# EAGLE design flexpcb segmented (EAGLE 9.6.2)
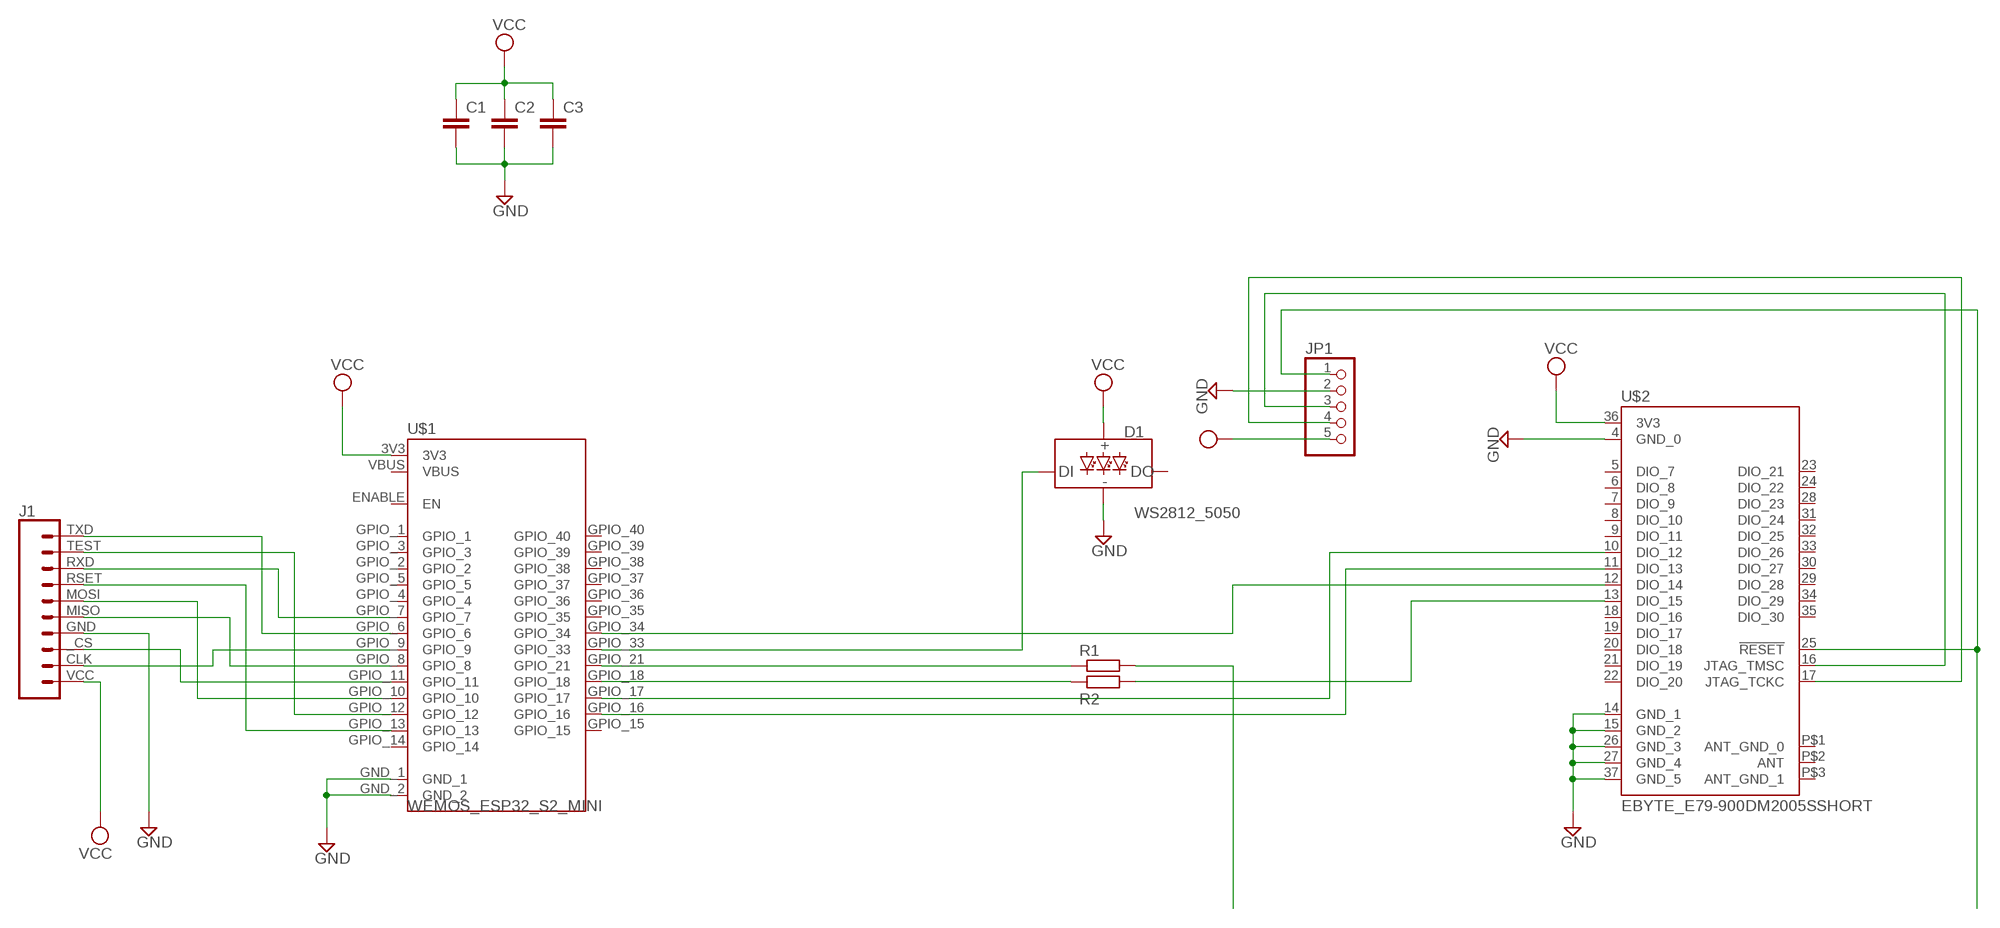
[diagram p0: schematic, sheet 1]

## Parts
C1  C-EUC1206  [C1206]
C2  C-EUC1206  [C1206]
C3  C-EUC1206  [C1206]
D1  WS2812_5050  [WS2812-5X5-4PIN]
J1  SOLUM_ZBS_DEBUGSEGMENTED_DISPLAY  [SOLUM_ZBS_DEBUG_SEG]
JP1  PINHD-1X55X2MM  [1_05X2MM]
R1  R-EU_R0805  [R0805]
R2  R-EU_R0805  [R0805]
U$1  WEMOS_ESP32_S2_MINI  [WEMOS_ESP32_S2_MINI]
U$2  EBYTE_E79-900DM2005SSHORT  [EBYTE_E79-900DM2005S_PARTIAL]

## Nets
GND [power]: C1.2 C2.2 C3.2 D1.GND J1.GND JP1.2 U$1.GND_1 U$1.GND_2 U$2.4(GND_0) U$2.14(GND_1) U$2.15(GND_2) U$2.26(GND_3) U$2.27(GND_4) U$2.37(GND_5)
N$1: JP1.1 U$2.25(!RESET)
N$2: R1.1 U$1.GPIO_21
N$3: R2.2 U$2.13(DIO_15)
N$4: R2.1 U$1.GPIO_18
N$5: U$1.GPIO_34 U$2.12(DIO_14)
N$6: U$1.GPIO_16 U$2.11(DIO_13)
N$7: U$1.GPIO_17 U$2.10(DIO_12)
N$8: D1.DI U$1.GPIO_33
N$9: JP1.3 U$2.16(JTAG_TMSC)
N$10: JP1.4 U$2.17(JTAG_TCKC)
N$11: J1.TEST U$1.GPIO_12
N$12: J1.RSET U$1.GPIO_13
N$13: J1._CS U$1.GPIO_11
N$14: J1.MOSI U$1.GPIO_10
N$15: J1.CLK U$1.GPIO_9
N$16: R1.2
N$17: J1.RXD U$1.GPIO_7
N$18: J1.TXD U$1.GPIO_6
N$19: J1.MISO U$1.GPIO_8
VCC [power]: C1.1 C2.1 C3.1 D1.VCC J1.VCC JP1.5 U$1.3V3 U$2.36(3V3)
Unconnected: D1.DO U$1.ENABLE(EN) U$1.GPIO_1 U$1.GPIO_2 U$1.GPIO_3 U$1.GPIO_4 U$1.GPIO_5 U$1.GPIO_14 U$1.GPIO_15 U$1.GPIO_35 U$1.GPIO_36 U$1.GPIO_37 U$1.GPIO_38 U$1.GPIO_39 U$1.GPIO_40 U$2.5(DIO_7) U$2.6(DIO_8) U$2.7(DIO_9) U$2.8(DIO_10) U$2.9(DIO_11) U$2.18(DIO_16) U$2.19(DIO_17) U$2.20(DIO_18) U$2.21(DIO_19) U$2.22(DIO_20) U$2.23(DIO_21) U$2.24(DIO_22) U$2.28(DIO_23) U$2.29(DIO_28) U$2.30(DIO_27) U$2.31(DIO_24) U$2.32(DIO_25) U$2.33(DIO_26) U$2.34(DIO_29) U$2.35(DIO_30)

## Power pins joined to a net without a drawn wire
ANT: U$2.P$2(ANT)
ANT_GND_0: U$2.P$1(ANT_GND_0)
ANT_GND_1: U$2.P$3(ANT_GND_1)
VBUS: U$1.VBUS

## Library data of the parts
C1-C3 = rcl:C-EU: CAPACITOR, European symbol; SPICEPREFIX: C
D1 = SparkFun-LED:WS2812: Addressable RGB LED - 1 Wire Common names: WS2812, SK6812, Neopixel, APA-106, etc. SMD LED with built-in controller IC. Color: Red/Green/Blue SparkFun Products: LED-SMD RGB (WS2812) <https://www.sparkfun.com/products/11821> LED - RGB Addressable, PTH, 5mm Diffused (5 Pack) <https://www.sparkfun.com/products/12986> LED - RGB Addressable, PTH, 5mm Clear (5 Pack) <https://www.sparkfun.com/products/12999> Blynk Board - ESP8266 <https://www.sparkfun.com/products/13794> Datasheet referenced for footprint: WS2812B-PTH <https://cdn.sparkfun.com/datasheets/Components/LED/COM-12877.pdf>; PROD_ID: DIO-12503
J1 = SparkFun-Connectors:SOLUM_ZBS_DEBUG: Multi connection point. Often used as Generic Header-pin footprint for 0.1 inch spaced/style header connections On any of the 0.1 inch spaced packages, you can populate with these: Break Away Headers - Straight <https://www.sparkfun.com/products/116> (PRT-00116) Break Away Male Headers - Right Angle <https://www.sparkfun.com/products/553> (PRT-00553) Female Headers <https://www.sparkfun.com/products/115> (PRT-00115) Break Away Headers - Machine Pin <https://www.sparkfun.com/products/117> (PRT-00117) Break Away Female Headers - Swiss Machine Pin <https://www.sparkfun.com/products/743> (PRT-00743) Arduino Stackable Header - 10 Pin <https://www.sparkfun.com/products/11376> (PRT-11376) For SCREWTERMINALS and SPRING TERMINALS visit here: Screw Terimnals on SparkFun.com <https://www.sparkfun.com/search/results?term=Screw+Terminals> (5mm/3.5mm/2.54mm spacing) This device is also useful as a general connection point to wire up your design to another part of your project. Our various solder wires solder well into these plated through hole pads. Hook-Up Wire - Assortment (Stranded, 22 AWG) <https://www.sparkfun.com/products/11375> (PRT-11375) Hook-Up Wire - Assortment (Solid Core, 22 AWG) <https://www.sparkfun.com/products/11367> (PRT-11367) View the entire wire category on our website here <https://www.sparkfun.com/categories/141> Special notes: Molex polarized connector foot print use with SKU : PRT-08231 with associated crimp pins and housings. 1MM SMD Version SKU: PRT-10208 NOTES ON THE VARIANTS LOCK and LOCK_LONGPADS... This footprint was designed to help hold the alignment of a through-hole component (i.e. 6-pin header) while soldering it into place. You may notice that each hole has been shifted either up or down by 0.005 of an inch from it's more standard position (which is a perfectly straight line). This slight alteration caused the pins (the squares in the middle) to touch the edges of the holes. Because they are alternating, it causes a "brace" to hold the component in place. 0.005 has proven to be the perfect amount of "off-center" position when using our standard breakaway headers. Although looks a little odd when you look at the bare footprint, once you have a header in there, the alteration is very hard to notice. Also,if you push a header all the way into place, it is covered up entirely on the bottom side.
JP1 = pinhead:PINHD-1X5: PIN HEADER
R1 R2 = rcl:R-EU_: RESISTOR, European symbol; SPICEPREFIX: R
U$1 = SparkFun-Connectors:WEMOS_ESP32_S2_MINI
U$2 = SparkFun-Connectors:EBYTE_E79-900DM2005S

## Net classes
0 default: width 0.12 mm, clearance 0.12 mm
1 power: width 0.61 mm, clearance 0.12 mm

## Board
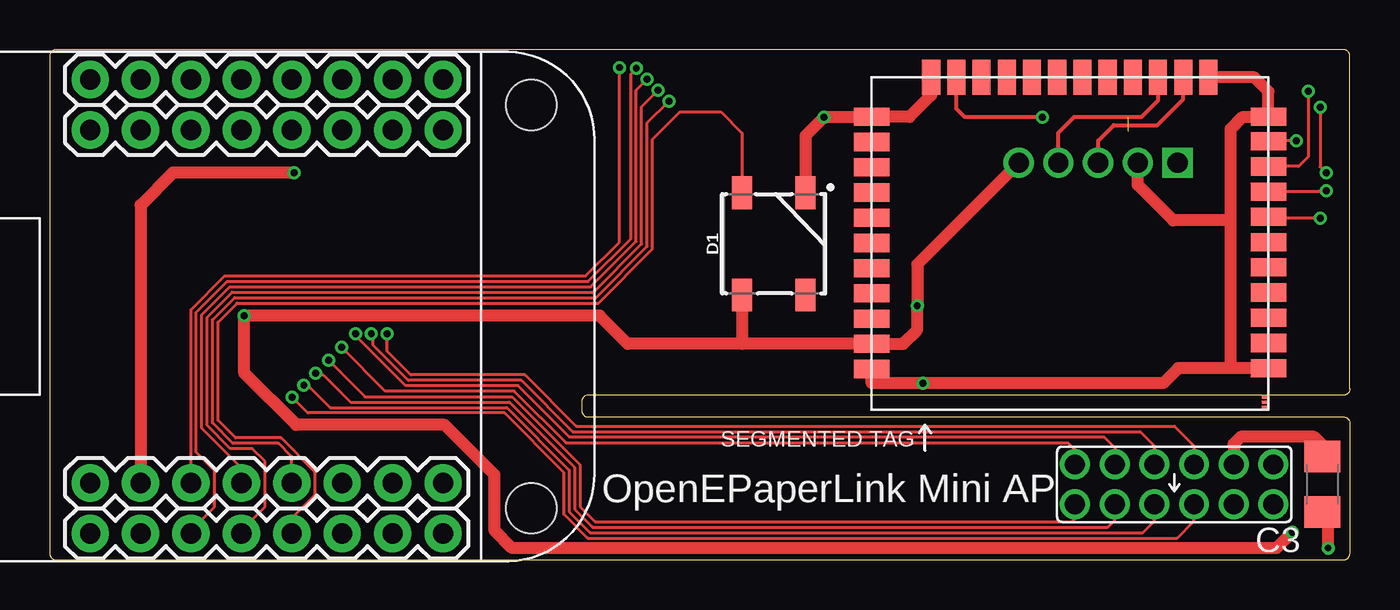
[diagram p1: board, top side]
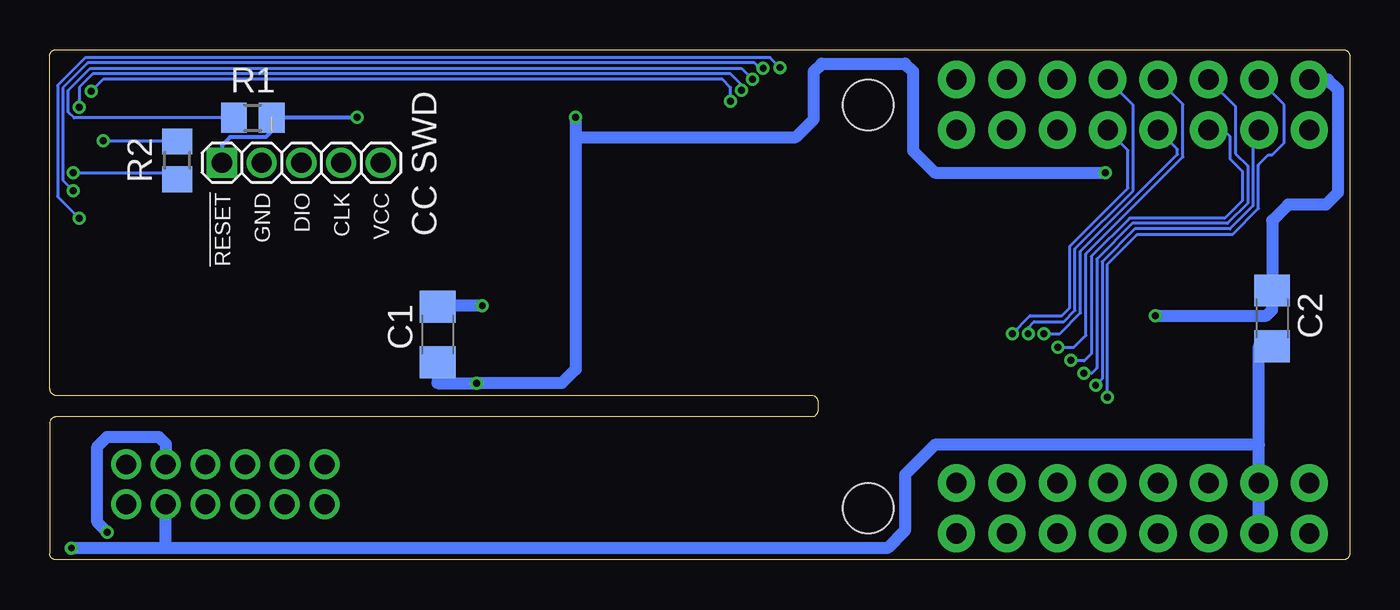
[diagram p2: board, bottom side, seen from below]

Size 65.5 x 25.7 mm. Coordinates in mm from the lower left corner, seen from the top.
Outline: 0,25.38 0,0.32 arc90 0.32,0 65.18,0 arc90 65.5,0.32 65.5,6.88 arc90 65.18,7.2 27.12,7.2 arc-90 26.8,7.52 26.8,7.98 arc-90 27.12,8.3 65.18,8.3 arc90 65.5,8.62 65.5,25.38 arc90 65.18,25.7 0.32,25.7 arc90 0,25.38
Copper layers (1*16): Top 0.035mm / dielectric 1.5mm / Bottom 0.035mm
Design rules "dirt_cheap_dirty_boards.v1.1 *": minimum track width 0.12mm, minimum drill 12mil, track to track 0.12mm, track to pad 0.12mm, pad to pad 0.12mm, via to via 0.12mm, smd to smd 0.12mm, copper to edge 10mil, drill to drill 10mil, minimum pad ring 10mil, minimum via ring 6mil, stop-mask expansion 2mil, vias tented up to drill 25mil, thermal gap 10mil

### Footprints (pad centres in the part's own frame; a part is rotated, then mirrored left to right if it is on the bottom)
C1206 = smd 1.6 x 1.8: 1 -1.4,0; 2 1.4,0
WS2812-5X5-4PIN = smd 1.651 x 1: DI 2.577,1.6; DO -2.577,-1.6; GND 2.577,-1.6; VCC -2.577,1.6
SOLUM_ZBS_DEBUG_SEG = drill 1 pad 1.27: _CS 3,1; CLK 5,-1; EPD_BG -5,-1; EPD_VCOM -5,1; GND -3,1; MISO 3,-1; MOSI 5,1; RSET 1,1; RXD 1,-1; TEST -1,1; TXD -1,-1; VCC -3,-1
1_05X2MM = drill 1.016 pad 1.3 square: 1 -4,0 | drill 1.016 pad 1.3: 2 -2,0; 3 0,0; 4 2,0; 5 4,0
R0805 = smd 1.3 x 1.5: 1 -0.95,0; 2 0.95,0
WEMOS_ESP32_S2_MINI = drill 1.016 pad 1.88: 3V3 -7.62,11.43; ENABLE 10.16,11.43; GND_1 -5.08,-8.89; GND_2 -5.08,-11.43; GPIO_1 10.16,8.89; GPIO_2 7.62,8.89; GPIO_3 7.62,11.43; GPIO_4 5.08,8.89; GPIO_5 5.08,11.43; GPIO_6 2.54,8.89; GPIO_7 2.54,11.43; GPIO_8 0,8.89; GPIO_9 0,11.43; GPIO_10 -2.54,8.89; GPIO_11 -2.54,11.43; GPIO_12 -5.08,11.43; GPIO_13 -5.08,8.89; GPIO_14 -7.62,8.89; GPIO_15 -7.62,-8.89; GPIO_16 -2.54,-11.43; GPIO_17 -2.54,-8.89; GPIO_18 0,-11.43; GPIO_21 0,-8.89; GPIO_33 2.54,-11.43; GPIO_34 2.54,-8.89; GPIO_35 5.08,-11.43; GPIO_36 5.08,-8.89; GPIO_37 7.62,-11.43; GPIO_38 7.62,-8.89; GPIO_39 10.16,-11.43; GPIO_40 10.16,-8.89; VBUS -7.62,-11.43 | hole 2.54: 14.605,10.16; 14.605,-10.16
EBYTE_E79-900DM2005S_PARTIAL = smd 1.778 x 0.914: 4 9.84,-5.52; 5 9.84,-4.25; 6 9.84,-2.98; 7 9.84,-1.71; 8 9.84,-0.44; 9 9.84,0.83; 10 9.84,2.1; 11 9.84,3.37; 12 9.84,4.64; 13 9.84,5.91; 14 9.84,7.14; 27 -10.16,7.14; 28 -10.16,5.87; 29 -10.16,4.6; 30 -10.16,3.33; 31 -10.16,2.06; 32 -10.16,0.79; 33 -10.16,-0.48; 34 -10.16,-1.75; 35 -10.16,-3.02; 36 -10.16,-4.29; 37 -10.16,-5.56 | smd 0.914 x 1.778: 15 6.81,9.13; 16 5.54,9.13; 17 4.27,9.13; 18 3,9.13; 19 1.73,9.13; 20 0.46,9.13; 21 -0.81,9.13; 22 -2.08,9.13; 23 -3.35,9.13; 24 -4.62,9.13; 25 -5.89,9.13; 26 -7.16,9.13 | smd 0.305 x 0.152: P$1 9.652,-7.493; P$2 9.652,-7.239; P$3 9.652,-6.985

### Placement (x,y rotation side)
C1  45.96,11.35 270 bottom
C2  3.91,12.16 270 bottom
C3  64.11,3.81 270 top
D1  36.48,15.92 90 top
J1  56.65,3.81 180 top
JP1  52.82,20 0 bottom
R1  55.26,22.27 0 bottom
R2  59.07,20.13 90 bottom
U$1  9.65,12.76 0 top
U$2  51.56,15.18 0 top

### Tracks (layer width: path | path; a pad name or v marks a point on that pad's centre or on a via)
GND  (via drill 0.35)
  Top 0.61: U$2.15 60.7,24.3 61.4,23.6 U$2.14 60.12,22.32 59.5,21.7 59.5,17.1 | 59.5,17.1 59.5,9.66 U$2.4 56.85,9.66 56.1,8.9 v44,8.9 41.4,8.9 U$2.37 | 59.5,17.1 56.6,17.1 54.82,18.88 JP1.2 | U$2.26 44.4,23.4 43.31,22.32 U$2.27 41.4,22.3 v39,22.3 38.08,21.38 D1.GND | v12.3,19.5 6.2,19.5 4.57,17.87 U$1.GND_1 | v64.4,0.6 64.4,2.41 C3.2
  Bottom 0.61: C2.2 4.57,10.76 U$1.GND_1 | U$1.GND_2 U$1.GND_1 | U$1.GND_1 4.57,5.8 20.9,5.8 22.4,4.3 22.4,1.5 23.3,0.6 59.65,0.6 | C1.2 45.96,8.9 v44,8.9 39.7,8.9 39,9.6 v39,22.3 39,21.3 27.9,21.3 27,22.2 27,24.6 26.6,25 22.4,25 22,24.6 22,20.6 20.9,19.5 v12.3,19.5 | 59.65,0.6 J1.GND | 59.65,0.6 v64.4,0.6
N$1  (via drill 0.35)  (1 unrouted)
  Top 0.203: v50,22.3 46.1,22.3 45.67,22.73 U$2.25
  Bottom 0.203: 54.31,22.3 v50,22.3 | 54.31,21.59 54.61,21.29 56.41,21.29 56.82,20.88 JP1.1
N$2  (via drill 0.35)
  Top 0.152: U$1.GPIO_21 9.65,4.65 7.66,6.64 7.66,12.36 9.05,13.76 27.25,13.76 29.55,16.05 29.55,23.65 v30.1,24.2
  Bottom 0.152: v30.1,24.2 30.65,24.75 63.45,24.75 64.56,23.64 64.56,22.55 64.27,22.27 R1.1
N$3  (via drill 0.35)
  Top 0.152: v62.8,21.1 U$2.13
  Bottom 0.152: R2.2 62.8,21.08 v62.8,21.1
N$4  (via drill 0.35)
  Top 0.152: U$1.GPIO_18 9.65,1.5 10.84,2.68 10.84,4.96 10.2,5.6 9.1,5.6 7.93,6.77 7.93,12.23 9.18,13.48 27.38,13.48 29.82,15.92 29.82,22.83 v30.64,23.66 | v64,22.8 64,19.8 v64.3,19.5
  Bottom 0.152: v30.64,23.66 30.64,23.93 31.2,24.48 63.32,24.48 64,23.8 v64,22.8 | R2.1 59.07,19.5 v64.3,19.5
N$5  (via drill 0.35)
  Top 0.152: U$1.GPIO_34 12.19,5.21 11.52,5.88 9.22,5.88 8.2,6.9 8.2,12.1 9.31,13.21 27.51,13.21 30.09,15.79 30.09,22.01 v31.19,23.11 | v63.4,23.6 63.4,20.3 62.91,19.82 U$2.12
  Bottom 0.152: v31.19,23.11 31.19,23.79 31.61,24.21 62.79,24.21 v63.4,23.6
N$6  (via drill 0.35)
  Top 0.152: U$1.GPIO_16 7.11,1.5 8.3,2.68 8.3,4.5 7.38,5.42 7.38,12.48 8.93,14.03 27.13,14.03 29.27,16.17 29.27,24.48 v29.55,24.75 | v64.3,18.6 64.3,18.55 U$2.11
  Bottom 0.152: v29.55,24.75 29.73,24.75 30,25.03 63.57,25.03 64.83,23.77 64.83,19.13 v64.3,18.6
N$7  (via drill 0.35)
  Top 0.152: U$1.GPIO_17 7.11,12.61 8.8,14.3 27,14.3 28.7,16 v28.7,24.8 | U$2.10 61.48,17.2 v64,17.2
  Bottom 0.152: v28.7,24.8 29.2,25.3 63.7,25.3 65.1,23.9 65.1,18.3 v64,17.2
N$8
  Top 0.152: U$1.GPIO_33 12.19,2.09 13.38,3.28 13.38,4.42 11.65,6.15 9.35,6.15 8.47,7.03 8.47,11.97 9.44,12.94 27.64,12.94 30.36,15.66 30.36,21.18 31.74,22.56 33.81,22.56 34.88,21.5 D1.DI
N$9
  Top 0.203: JP1.3 52.82,21.12 53.6,21.9 55.8,21.9 57.1,23.2 U$2.16
N$10
  Top 0.203: U$2.17 55.83,23.13 55,22.3 51.6,22.3 50.8,21.5 50.8,20 JP1.4
N$11  (via drill 0.35)
  Top 0.152: v12.2,8.2 13,7.4 22.9,7.4 25.9,4.4 25.9,2.3 27.1,1.1 56.8,1.1 57.65,1.95 J1.TEST
  Bottom 0.152: v12.2,8.2 12.2,14.9 10.7,16.4 5.9,16.4 4.6,17.7 4.6,19.9 4.1,20.4 3.9,20.4 3.3,21 3.3,22.92 U$1.GPIO_12
N$12  (via drill 0.35)
  Top 0.152: v12.8,8.8 13,8.8 14.13,7.67 23.03,7.67 26.17,4.53 26.17,2.43 27.23,1.37 55.07,1.37 55.65,1.95 J1.RSET
  Bottom 0.152: U$1.GPIO_13 4.87,21.65 4.87,17.83 6.03,16.67 10.83,16.67 12.47,15.03 12.47,9.13 v12.8,8.8
N$13  (via drill 0.35)
  Top 0.152: v13.4,9.4 13.4,9.32 13.77,9.32 15.15,7.94 23.16,7.94 26.45,4.66 26.45,2.55 27.35,1.65 53.3,1.65 53.65,2 J1._CS
  Bottom 0.152: U$1.GPIO_11 5.76,22.84 5.76,20.46 5.14,19.85 5.14,17.96 6.16,16.95 10.96,16.95 12.74,15.16 12.74,9.66 13,9.4 v13.4,9.4
N$14  (via drill 0.35)
  Top 0.152: v14.05,10.05 v14.04,10.05 15.88,8.22 23.28,8.22 26.72,4.78 26.72,2.68 27.48,1.92 51.5,1.92 51.65,2.07 J1.MOSI
  Bottom 0.152: U$1.GPIO_10 6.35,21.65 6.03,21.33 6.03,20.19 5.42,19.58 5.42,18.08 6.28,17.22 11.08,17.22 13.02,15.28 13.02,10.38 13.38,10.02 14.05,10.02 v14.05,10.05
N$15  (via drill 0.35)
  Top 0.152: v14.7,10.7 16.9,8.5 23.4,8.5 26,5.9 51.3,5.9 51.65,5.55 J1.CLK
  Bottom 0.152: v14.7,10.7 13.9,10.7 13.29,11.31 13.29,15.41 8.4,20.3 8.4,22.94 U$1.GPIO_9
N$17  (via drill 0.35)
  Top 0.152: v16.2,11.4 16.3,11.4 16.3,10.8 18.05,9.04 23.76,9.04 26.34,6.46 54.94,6.46 55.65,5.75 J1.RXD
  Bottom 0.152: v16.2,11.4 16.2,11.7 15.9,12 14.4,12 13.83,12.57 13.83,15.67 10.9,18.6 10.9,22.91 U$1.GPIO_7
N$18  (via drill 0.35)
  Top 0.152: v17,11.4 17,10.5 18.18,9.32 23.94,9.32 26.52,6.74 56.66,6.74 57.65,5.75 J1.TXD
  Bottom 0.152: v17,11.4 16.1,12.3 14.5,12.3 14.11,12.69 14.11,15.79 11.17,18.73 11.17,20.63 U$1.GPIO_6
N$19  (via drill 0.35)
  Top 0.152: v15.4,11.4 15.3,11.4 17.93,8.77 23.59,8.77 26.17,6.19 53.11,6.19 53.65,5.65 J1.MISO
  Bottom 0.152: v15.4,11.4 14.6,11.4 13.56,12.44 13.56,15.54 8.67,20.43 8.67,20.67 U$1.GPIO_8
VCC  (via drill 0.35)
  Top 0.61: JP1.5 43.7,14.89 v43.7,12.8 43.7,11.6 42.98,10.89 U$2.36 34.88,10.89 | 34.88,10.89 29.11,10.89 27.7,12.3 v9.8,12.3 9.8,9.4 12.4,6.8 19.9,6.8 22.4,4.3 22.4,1.5 23.3,0.6 61.8,0.6 v62.6,1.4 | D1.VCC 34.88,10.89 | C3.1 64.11,5.79 63.7,6.2 60,6.2 59.65,5.85 J1.VCC
  Bottom 0.61: v43.7,12.8 45.96,12.8 C1.1 | v9.8,12.3 4.2,12.3 3.91,12.59 C2.1 3.91,17.09 3.1,17.9 1.2,17.9 0.6,18.5 0.6,23.7 1.09,24.19 U$1.3V3 | v62.6,1.4 63.1,1.9 63.1,5.7 62.6,6.2 60,6.2 59.65,5.85 J1.VCC

### Text on the board
tNames: SEGMENTED TAG | OpenEPaperLink Mini AP
bNames: VCC | CLK | DIO | GND | !RESET | CC SWD